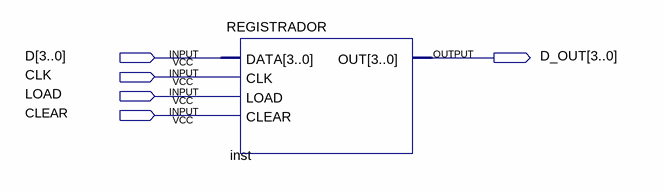
[diagram p0: schematic sheet]
// Quartus schematic TESTE_REGISTRADOR.bdf as structural Verilog: 1 symbols, 5 pins
module TESTE_REGISTRADOR (
  input  [3:0] D,
  input  CLK,
  input  LOAD,
  input  CLEAR,
  output [3:0] D_OUT
);

  REGISTRADOR inst (.DATA(D), .CLK(CLK), .LOAD(LOAD), .CLEAR(CLEAR), .OUT(D_OUT));
endmodule
